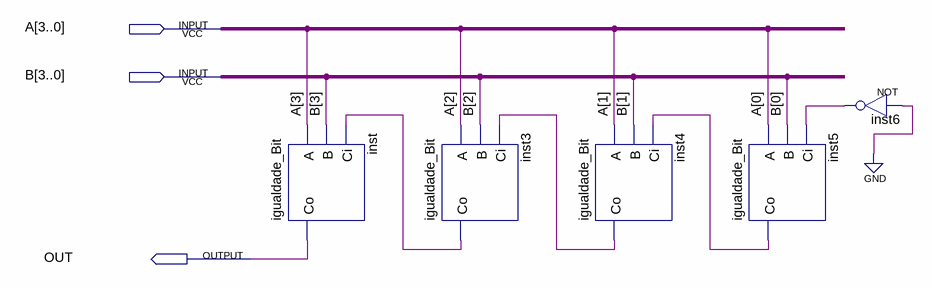
[diagram p0: schematic sheet]
// Quartus schematic igualdade.bdf as structural Verilog: 5 symbols, 3 pins
module igualdade (
  input  [3:0] A,
  input  [3:0] B,
  output OUT
);

  wire inst3_co, inst4_co, inst5_co, inst6_out;

  igualdade_Bit inst (.A(A[3]), .B(B[3]), .Ci(inst3_co), .Co(OUT));
  igualdade_Bit inst3 (.A(A[2]), .B(B[2]), .Ci(inst4_co), .Co(inst3_co));
  igualdade_Bit inst4 (.A(A[1]), .B(B[1]), .Ci(inst5_co), .Co(inst4_co));
  igualdade_Bit inst5 (.A(A[0]), .B(B[0]), .Ci(inst6_out), .Co(inst5_co));
  not inst6 (inst6_out, 1'b0);
endmodule
